# Altium schematic sheet FIT_PM_Dual_Range_AFE.SchDoc: FIT_PM_Dual_Range_AFE
size 420 x 297 mm; CheckedBy: G.Kasprowicz; Author: INR Moscow; CompanyName: WUT ISE; DrawnBy: F. Świtakowski; Organization: WUT ISE; Address1: PW ISE; Address2: Nowowiejska 15/19 00-665 Warsaw; Address3: gkasprow@gmail.com; DocumentNumber: 1; Revision: 2; SheetNumber: 1; SheetTotal: 21; ModifiedBy: -; CheckedDate: -; Title2: TOP; DivGrp: WUT ISE; Designer: INR RAS; ModifiedDate: -; ProjectName: Sensor Box
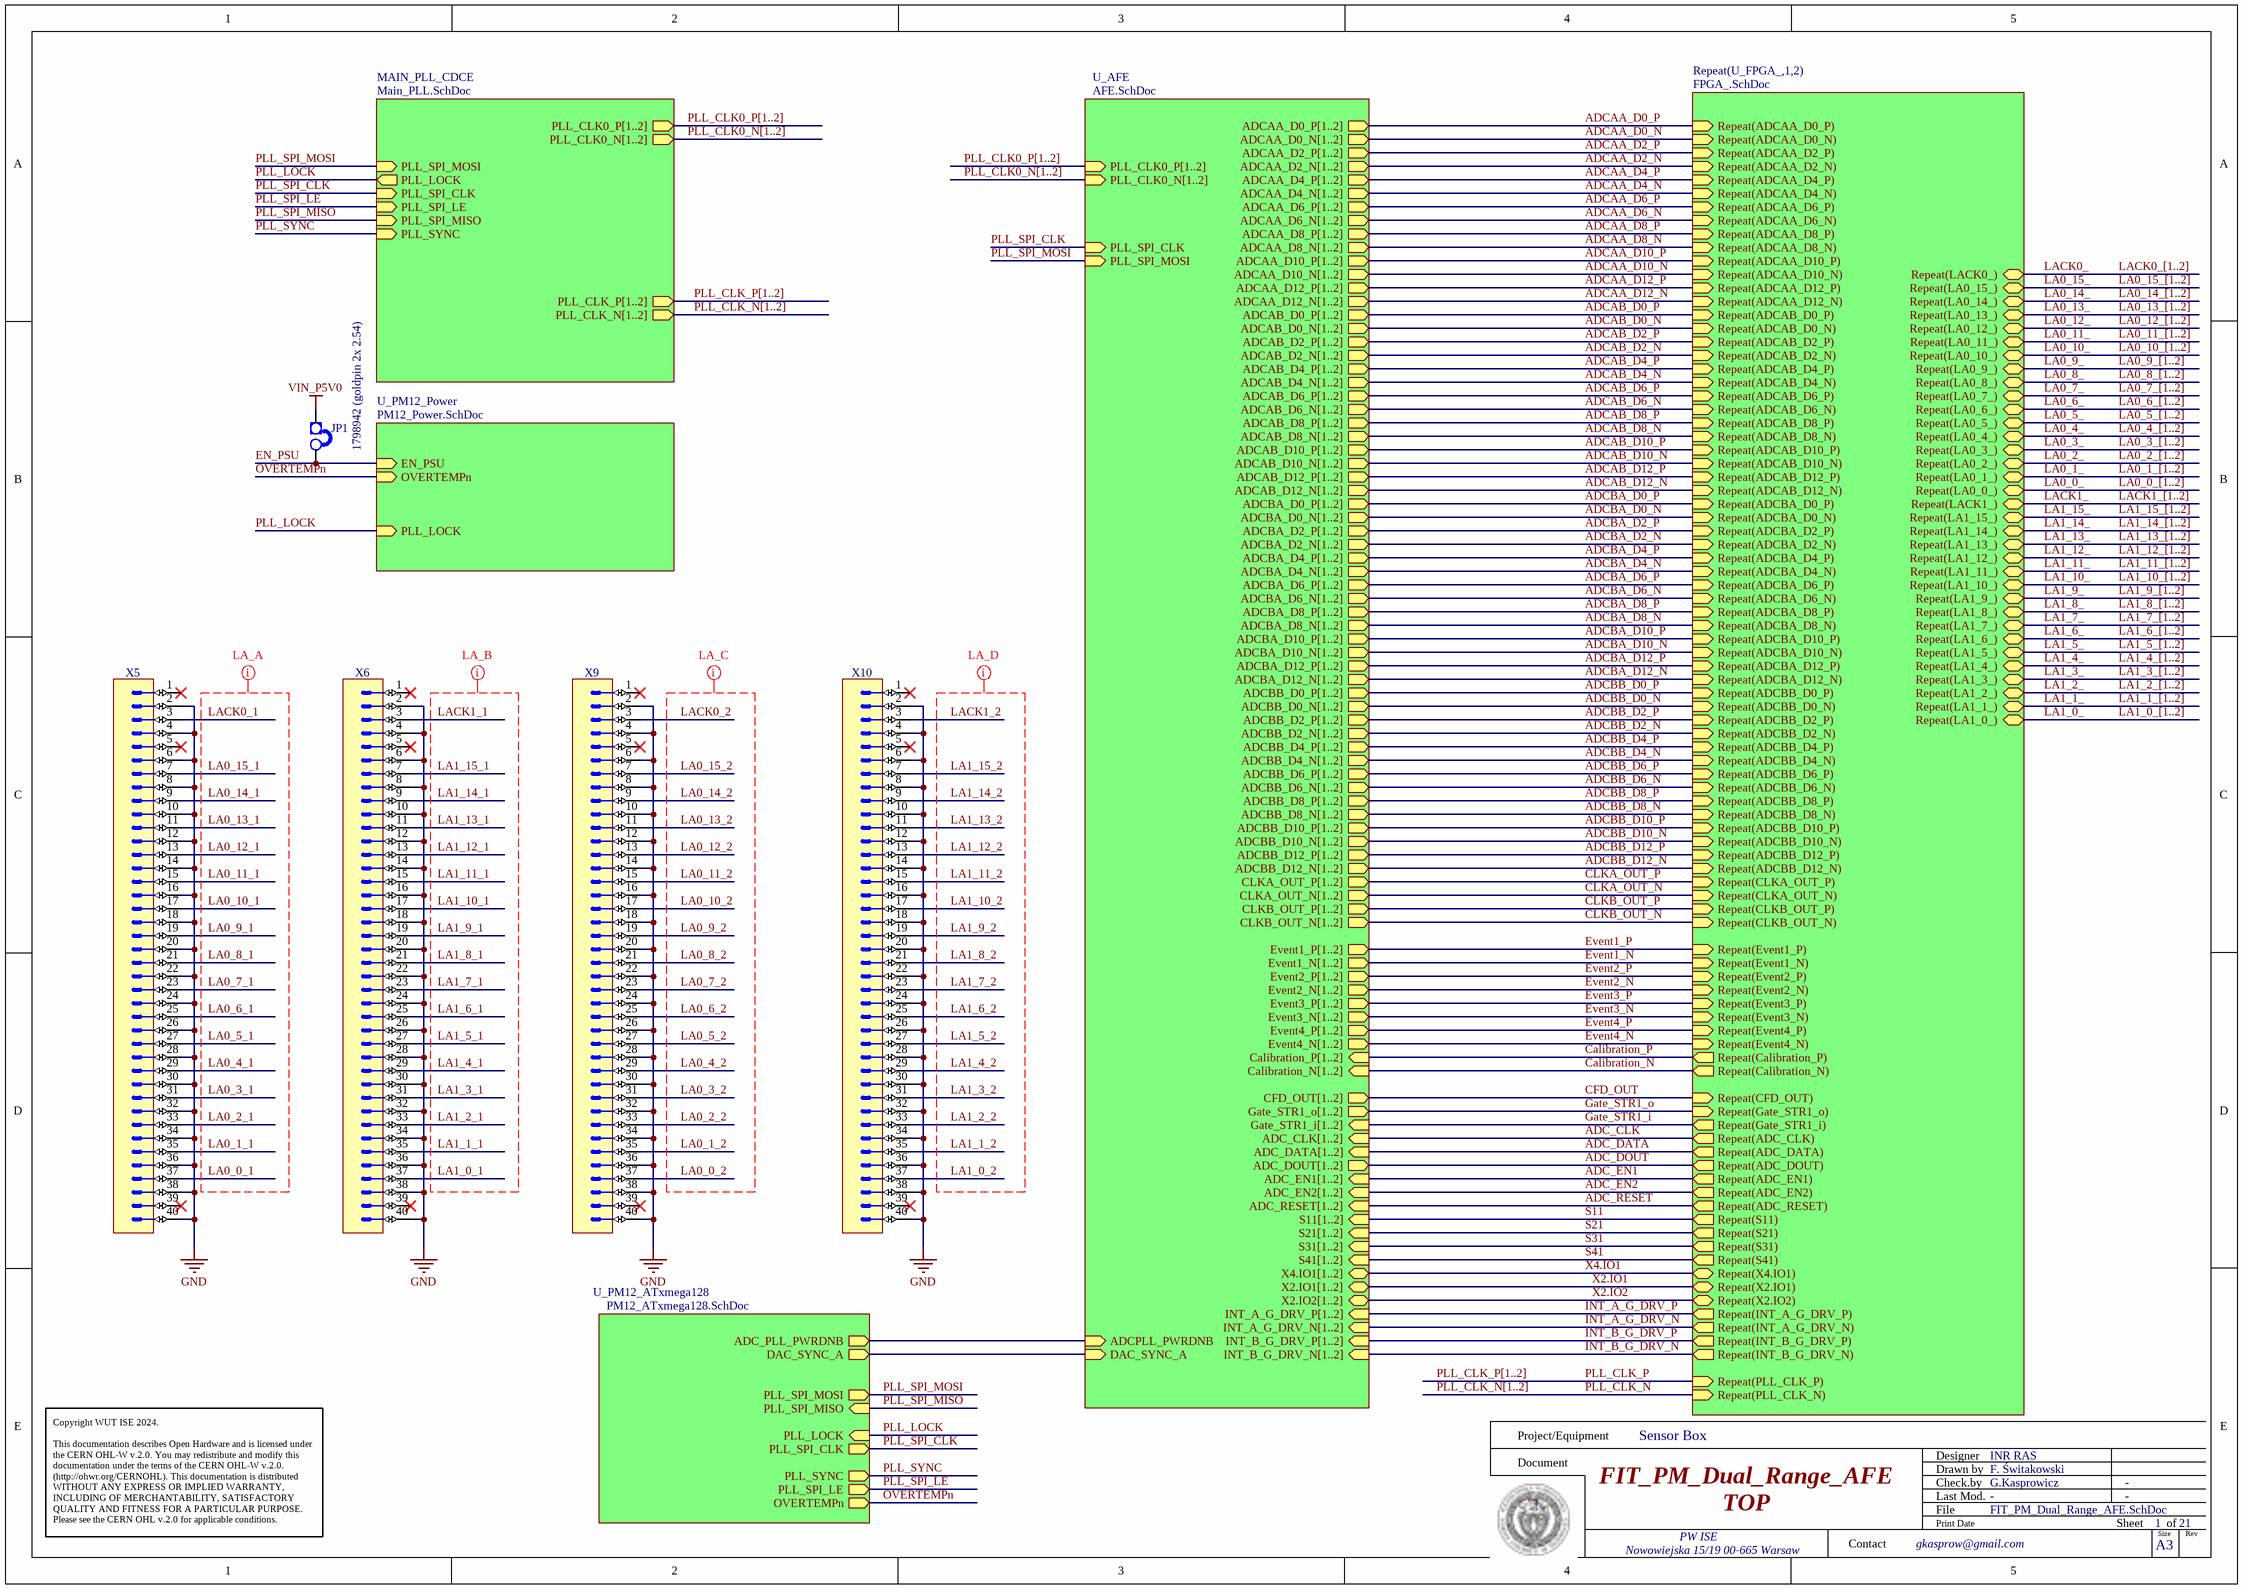
[diagram p0: FIT_PM_Dual_Range_AFE.SchDoc]

## Parts
JP1  1798942 (goldpin 2x 2.54)  [jump]
X5  (no value)  [CONNFLY_DS1013-40SSIB1-B-0]
X6  (no value)  [CONNFLY_DS1013-40SSIB1-B-0]
X9  (no value)  [CONNFLY_DS1013-40SSIB1-B-0]
X10  (no value)  [CONNFLY_DS1013-40SSIB1-B-0]

## Sub-sheets
MAIN_PLL_CDCE = Main_PLL.SchDoc: PLL_SPI_CLK (in), PLL_SYNC (in), PLL_LOCK (out), PLL_SPI_LE (in), PLL_SPI_MOSI (in), PLL_CLK0_P[1..2] (out), PLL_CLK0_N[1..2] (out), PLL_SPI_MISO (in), PLL_CLK_P[1..2] (out), PLL_CLK_N[1..2] (out)
Repeat(U_FPGA_,1,2) = FPGA_.SchDoc: Repeat(CLKB_OUT_P) (in), Repeat(CLKB_OUT_N) (in), Repeat(PLL_CLK_P) (in), Repeat(PLL_CLK_N) (in), Repeat(X4.IO1) (bidir), Repeat(X2.IO1) (bidir), Repeat(X2.IO2) (bidir), Repeat(ADCAA_D0_P) (in), Repeat(ADCAA_D0_N) (in), Repeat(ADCAA_D2_P) (in), Repeat(ADCAA_D2_N) (in), Repeat(ADCAA_D4_P) (in), Repeat(ADCAA_D4_N) (in), Repeat(ADCAA_D6_P) (in), Repeat(ADCAA_D6_N) (in), Repeat(ADCAA_D8_P) (in), Repeat(ADCAA_D8_N) (in), Repeat(ADCAA_D10_P) (in), Repeat(ADCAA_D10_N) (in), Repeat(ADCAA_D12_P) (in), Repeat(ADCAA_D12_N) (in), Repeat(CLKA_OUT_P) (in), Repeat(CLKA_OUT_N) (in), Repeat(ADCAB_D0_P) (in), Repeat(ADCAB_D0_N) (in), Repeat(ADCAB_D2_P) (in), Repeat(ADCAB_D2_N) (in), Repeat(ADCAB_D4_P) (in), Repeat(ADCAB_D4_N) (in), Repeat(ADCAB_D6_P) (in), Repeat(ADCAB_D6_N) (in), Repeat(ADCAB_D8_P) (in), Repeat(ADCAB_D8_N) (in), Repeat(ADCAB_D10_P) (in), Repeat(ADCAB_D10_N) (in), Repeat(ADCAB_D12_P) (in), Repeat(ADCAB_D12_N) (in), Repeat(ADCBA_D0_P) (in), Repeat(ADCBA_D0_N) (in), Repeat(ADCBA_D2_P) (in), Repeat(ADCBA_D2_N) (in), Repeat(ADCBA_D4_P) (in), Repeat(ADCBA_D4_N) (in), Repeat(ADCBA_D6_P) (in), Repeat(ADCBA_D6_N) (in), Repeat(ADCBA_D8_P) (in), Repeat(ADCBA_D8_N) (in), Repeat(ADCBA_D10_P) (in), Repeat(ADCBA_D10_N) (in), Repeat(ADCBA_D12_P) (in), Repeat(ADCBA_D12_N) (in), Repeat(ADCBB_D0_P) (in), Repeat(ADCBB_D0_N) (in), Repeat(ADCBB_D2_P) (in), Repeat(ADCBB_D2_N) (in), Repeat(ADCBB_D4_P) (in), Repeat(ADCBB_D4_N) (in), Repeat(ADCBB_D6_P) (in), Repeat(ADCBB_D6_N) (in), Repeat(ADCBB_D8_P) (in), Repeat(ADCBB_D8_N) (in), Repeat(ADCBB_D10_P) (in), Repeat(ADCBB_D10_N) (in), Repeat(ADCBB_D12_P) (in), Repeat(ADCBB_D12_N) (in), Repeat(Event1_P) (in), Repeat(Event1_N) (in), Repeat(CFD_OUT) (in), Repeat(Gate_STR1_o) (in), Repeat(Gate_STR1_i) (out), Repeat(ADC_CLK) (out), Repeat(ADC_DATA) (out), Repeat(ADC_DOUT) (out), Repeat(ADC_EN1) (out), Repeat(ADC_EN2) (out), Repeat(ADC_RESET) (out), Repeat(INT_A_G_DRV_P) (out), Repeat(INT_B_G_DRV_P) (out), Repeat(LACK0_) (bidir), Repeat(LA0_15_) (bidir), Repeat(LA0_14_) (bidir), Repeat(LA0_13_) (bidir), Repeat(LA0_12_) (bidir), Repeat(LA0_11_) (bidir), Repeat(LA0_10_) (bidir), Repeat(LA0_9_) (bidir), Repeat(LA0_8_) (bidir), Repeat(LA0_7_) (bidir), Repeat(LA0_6_) (bidir), Repeat(LA0_5_) (bidir), Repeat(LA0_4_) (bidir), Repeat(LA0_3_) (bidir), Repeat(LA0_2_) (bidir), Repeat(LA0_1_) (bidir), Repeat(LA0_0_) (bidir), Repeat(LACK1_) (bidir), Repeat(LA1_15_) (bidir), Repeat(LA1_14_) (bidir), Repeat(LA1_13_) (bidir), Repeat(LA1_12_) (bidir), Repeat(LA1_11_) (bidir), Repeat(LA1_10_) (bidir), Repeat(LA1_9_) (bidir), Repeat(LA1_8_) (bidir), Repeat(LA1_7_) (bidir), Repeat(LA1_6_) (bidir), Repeat(LA1_5_) (bidir), Repeat(LA1_4_) (bidir), Repeat(LA1_3_) (bidir), Repeat(LA1_2_) (bidir), Repeat(LA1_1_) (bidir), Repeat(LA1_0_) (bidir), Repeat(INT_A_G_DRV_N) (out), Repeat(INT_B_G_DRV_N) (out), Repeat(Event2_P) (in), Repeat(Event2_N) (in), Repeat(Event3_P) (in), Repeat(Event3_N) (in), Repeat(Event4_P) (in), Repeat(Event4_N) (in), Repeat(Calibration_P) (out), Repeat(Calibration_N) (out), Repeat(S11) (out), Repeat(S21) (out), Repeat(S31) (out), Repeat(S41) (out)
U_AFE = AFE.SchDoc: ADCPLL_PWRDNB (in), Event1_P[1..2] (out), PLL_CLK0_P[1..2] (in), PLL_CLK0_N[1..2] (in), ADCAA_D0_P[1..2] (out), ADCAA_D0_N[1..2] (out), ADCAA_D2_P[1..2] (out), ADCAA_D2_N[1..2] (out), ADCAA_D4_P[1..2] (out), ADCAA_D4_N[1..2] (out), ADCAA_D6_P[1..2] (out), ADCAA_D6_N[1..2] (out), ADCAA_D8_P[1..2] (out), ADCAA_D8_N[1..2] (out), ADCAA_D10_P[1..2] (out), ADCAA_D10_N[1..2] (out), ADCAA_D12_P[1..2] (out), ADCAA_D12_N[1..2] (out), ADCAB_D0_P[1..2] (out), ADCAB_D0_N[1..2] (out), ADCAB_D2_P[1..2] (out), ADCAB_D2_N[1..2] (out), ADCAB_D4_P[1..2] (out), ADCAB_D4_N[1..2] (out), ADCAB_D6_P[1..2] (out), ADCAB_D6_N[1..2] (out), ADCAB_D8_P[1..2] (out), ADCAB_D8_N[1..2] (out), ADCAB_D10_P[1..2] (out), ADCAB_D10_N[1..2] (out), ADCAB_D12_P[1..2] (out), ADCAB_D12_N[1..2] (out), ADCBA_D0_P[1..2] (out), ADCBA_D0_N[1..2] (out), ADCBA_D2_P[1..2] (out), ADCBA_D2_N[1..2] (out), ADCBA_D4_P[1..2] (out), ADCBA_D4_N[1..2] (out), ADCBA_D6_P[1..2] (out), ADCBA_D6_N[1..2] (out), ADCBA_D8_P[1..2] (out), ADCBA_D8_N[1..2] (out), ADCBA_D10_P[1..2] (out), ADCBA_D10_N[1..2] (out), ADCBA_D12_P[1..2] (out), ADCBA_D12_N[1..2] (out), ADCBB_D0_P[1..2] (out), ADCBB_D0_N[1..2] (out), ADCBB_D2_P[1..2] (out), ADCBB_D2_N[1..2] (out), ADCBB_D4_P[1..2] (out), ADCBB_D4_N[1..2] (out), ADCBB_D6_P[1..2] (out), ADCBB_D6_N[1..2] (out), ADCBB_D8_P[1..2] (out), ADCBB_D8_N[1..2] (out), ADCBB_D10_P[1..2] (out), ADCBB_D10_N[1..2] (out), ADCBB_D12_P[1..2] (out), ADCBB_D12_N[1..2] (out), CLKA_OUT_P[1..2] (out), CLKA_OUT_N[1..2] (out), CLKB_OUT_P[1..2] (out), CLKB_OUT_N[1..2] (out), DAC_SYNC_A (in), Event1_N[1..2] (out), CFD_OUT[1..2] (out), Gate_STR1_o[1..2] (out), Gate_STR1_i[1..2] (in), ADC_CLK[1..2] (in), ADC_DATA[1..2] (in), ADC_DOUT[1..2] (out), ADC_EN1[1..2] (in), ADC_EN2[1..2] (in), ADC_RESET[1..2] (in), PLL_SPI_CLK (in), PLL_SPI_MOSI (in), INT_A_G_DRV_P[1..2] (in), INT_B_G_DRV_P[1..2] (in), X4.IO1[1..2] (bidir), X2.IO1[1..2] (bidir), X2.IO2[1..2] (bidir), INT_A_G_DRV_N[1..2] (in), INT_B_G_DRV_N[1..2] (in), Event2_P[1..2] (out), Event2_N[1..2] (out), Event3_P[1..2] (out), Event3_N[1..2] (out), Event4_P[1..2] (out), Event4_N[1..2] (out), Calibration_P[1..2] (in), Calibration_N[1..2] (in), S11[1..2] (in), S21[1..2] (in), S31[1..2] (in), S41[1..2] (in)
U_PM12_ATxmega128 = PM12_ATxmega128.SchDoc: ADC_PLL_PWRDNB (out), PLL_SPI_MOSI (out), DAC_SYNC_A (out), PLL_SPI_CLK (out), PLL_SPI_MISO (in), PLL_SYNC (out), PLL_LOCK (in), PLL_SPI_LE (out), OVERTEMPn (out)
U_PM12_Power = PM12_Power.SchDoc: EN_PSU (in), OVERTEMPn (in), PLL_LOCK (in)

## Nets
GND: X5.2 X5.4 X5.6 X5.8 X5.10 X5.12 X5.14 X5.16 X5.18 X5.20 X5.22 X5.24 X5.26 X5.28 X5.30 X5.32 X5.34 X5.36 X5.38 X5.40 X6.2 X6.4 X6.6 X6.8 X6.10 X6.12 X6.14 X6.16 X6.18 X6.20 X6.22 X6.24 X6.26 X6.28 X6.30 X6.32 X6.34 X6.36 X6.38 X6.40 X9.2 X9.4 X9.6 X9.8 X9.10 X9.12 X9.14 X9.16 X9.18 X9.20 X9.22 X9.24 X9.26 X9.28 X9.30 X9.32 X9.34 X9.36 X9.38 X9.40 X10.2 X10.4 X10.6 X10.8 X10.10 X10.12 X10.14 X10.16 X10.18 X10.20 X10.22 X10.24 X10.26 X10.28 X10.30 X10.32 X10.34 X10.36 X10.38 X10.40
VIN_P5V0: JP1.1(E1)
ADC_CLK: sheet Repeat(U_FPGA_,1,2)/Repeat(ADC_CLK)
ADC_DATA: sheet Repeat(U_FPGA_,1,2)/Repeat(ADC_DATA)
ADC_DOUT: sheet Repeat(U_FPGA_,1,2)/Repeat(ADC_DOUT)
ADC_EN1: sheet Repeat(U_FPGA_,1,2)/Repeat(ADC_EN1)
ADC_EN2: sheet Repeat(U_FPGA_,1,2)/Repeat(ADC_EN2)
ADC_RESET: sheet Repeat(U_FPGA_,1,2)/Repeat(ADC_RESET)
ADCAA_D0_N: sheet Repeat(U_FPGA_,1,2)/Repeat(ADCAA_D0_N)
ADCAA_D0_P: sheet Repeat(U_FPGA_,1,2)/Repeat(ADCAA_D0_P)
ADCAA_D2_N: sheet Repeat(U_FPGA_,1,2)/Repeat(ADCAA_D2_N)
ADCAA_D2_P: sheet Repeat(U_FPGA_,1,2)/Repeat(ADCAA_D2_P)
ADCAA_D4_N: sheet Repeat(U_FPGA_,1,2)/Repeat(ADCAA_D4_N)
ADCAA_D4_P: sheet Repeat(U_FPGA_,1,2)/Repeat(ADCAA_D4_P)
ADCAA_D6_N: sheet Repeat(U_FPGA_,1,2)/Repeat(ADCAA_D6_N)
ADCAA_D6_P: sheet Repeat(U_FPGA_,1,2)/Repeat(ADCAA_D6_P)
ADCAA_D8_N: sheet Repeat(U_FPGA_,1,2)/Repeat(ADCAA_D8_N)
ADCAA_D8_P: sheet Repeat(U_FPGA_,1,2)/Repeat(ADCAA_D8_P)
ADCAA_D10_N: sheet Repeat(U_FPGA_,1,2)/Repeat(ADCAA_D10_N)
ADCAA_D10_P: sheet Repeat(U_FPGA_,1,2)/Repeat(ADCAA_D10_P)
ADCAA_D12_N: sheet Repeat(U_FPGA_,1,2)/Repeat(ADCAA_D12_N)
ADCAA_D12_P: sheet Repeat(U_FPGA_,1,2)/Repeat(ADCAA_D12_P)
ADCAB_D0_N: sheet Repeat(U_FPGA_,1,2)/Repeat(ADCAB_D0_N)
ADCAB_D0_P: sheet Repeat(U_FPGA_,1,2)/Repeat(ADCAB_D0_P)
ADCAB_D2_N: sheet Repeat(U_FPGA_,1,2)/Repeat(ADCAB_D2_N)
ADCAB_D2_P: sheet Repeat(U_FPGA_,1,2)/Repeat(ADCAB_D2_P)
ADCAB_D4_N: sheet Repeat(U_FPGA_,1,2)/Repeat(ADCAB_D4_N)
ADCAB_D4_P: sheet Repeat(U_FPGA_,1,2)/Repeat(ADCAB_D4_P)
ADCAB_D6_N: sheet Repeat(U_FPGA_,1,2)/Repeat(ADCAB_D6_N)
ADCAB_D6_P: sheet Repeat(U_FPGA_,1,2)/Repeat(ADCAB_D6_P)
ADCAB_D8_N: sheet Repeat(U_FPGA_,1,2)/Repeat(ADCAB_D8_N)
ADCAB_D8_P: sheet Repeat(U_FPGA_,1,2)/Repeat(ADCAB_D8_P)
ADCAB_D10_N: sheet Repeat(U_FPGA_,1,2)/Repeat(ADCAB_D10_N)
ADCAB_D10_P: sheet Repeat(U_FPGA_,1,2)/Repeat(ADCAB_D10_P)
ADCAB_D12_N: sheet Repeat(U_FPGA_,1,2)/Repeat(ADCAB_D12_N)
ADCAB_D12_P: sheet Repeat(U_FPGA_,1,2)/Repeat(ADCAB_D12_P)
ADCBA_D0_N: sheet Repeat(U_FPGA_,1,2)/Repeat(ADCBA_D0_N)
ADCBA_D0_P: sheet Repeat(U_FPGA_,1,2)/Repeat(ADCBA_D0_P)
ADCBA_D2_N: sheet Repeat(U_FPGA_,1,2)/Repeat(ADCBA_D2_N)
ADCBA_D2_P: sheet Repeat(U_FPGA_,1,2)/Repeat(ADCBA_D2_P)
ADCBA_D4_N: sheet Repeat(U_FPGA_,1,2)/Repeat(ADCBA_D4_N)
ADCBA_D4_P: sheet Repeat(U_FPGA_,1,2)/Repeat(ADCBA_D4_P)
ADCBA_D6_N: sheet Repeat(U_FPGA_,1,2)/Repeat(ADCBA_D6_N)
ADCBA_D6_P: sheet Repeat(U_FPGA_,1,2)/Repeat(ADCBA_D6_P)
ADCBA_D8_N: sheet Repeat(U_FPGA_,1,2)/Repeat(ADCBA_D8_N)
ADCBA_D8_P: sheet Repeat(U_FPGA_,1,2)/Repeat(ADCBA_D8_P)
ADCBA_D10_N: sheet Repeat(U_FPGA_,1,2)/Repeat(ADCBA_D10_N)
ADCBA_D10_P: sheet Repeat(U_FPGA_,1,2)/Repeat(ADCBA_D10_P)
ADCBA_D12_N: sheet Repeat(U_FPGA_,1,2)/Repeat(ADCBA_D12_N)
ADCBA_D12_P: sheet Repeat(U_FPGA_,1,2)/Repeat(ADCBA_D12_P)
ADCBB_D0_N: sheet Repeat(U_FPGA_,1,2)/Repeat(ADCBB_D0_N)
ADCBB_D0_P: sheet Repeat(U_FPGA_,1,2)/Repeat(ADCBB_D0_P)
ADCBB_D2_N: sheet Repeat(U_FPGA_,1,2)/Repeat(ADCBB_D2_N)
ADCBB_D2_P: sheet Repeat(U_FPGA_,1,2)/Repeat(ADCBB_D2_P)
ADCBB_D4_N: sheet Repeat(U_FPGA_,1,2)/Repeat(ADCBB_D4_N)
ADCBB_D4_P: sheet Repeat(U_FPGA_,1,2)/Repeat(ADCBB_D4_P)
ADCBB_D6_N: sheet Repeat(U_FPGA_,1,2)/Repeat(ADCBB_D6_N)
ADCBB_D6_P: sheet Repeat(U_FPGA_,1,2)/Repeat(ADCBB_D6_P)
ADCBB_D8_N: sheet Repeat(U_FPGA_,1,2)/Repeat(ADCBB_D8_N)
ADCBB_D8_P: sheet Repeat(U_FPGA_,1,2)/Repeat(ADCBB_D8_P)
ADCBB_D10_N: sheet Repeat(U_FPGA_,1,2)/Repeat(ADCBB_D10_N)
ADCBB_D10_P: sheet Repeat(U_FPGA_,1,2)/Repeat(ADCBB_D10_P)
ADCBB_D12_N: sheet Repeat(U_FPGA_,1,2)/Repeat(ADCBB_D12_N)
ADCBB_D12_P: sheet Repeat(U_FPGA_,1,2)/Repeat(ADCBB_D12_P)
Calibration_N: sheet Repeat(U_FPGA_,1,2)/Repeat(Calibration_N)
Calibration_P: sheet Repeat(U_FPGA_,1,2)/Repeat(Calibration_P)
CFD_OUT: sheet Repeat(U_FPGA_,1,2)/Repeat(CFD_OUT)
CLKA_OUT_N: sheet Repeat(U_FPGA_,1,2)/Repeat(CLKA_OUT_N)
CLKA_OUT_P: sheet Repeat(U_FPGA_,1,2)/Repeat(CLKA_OUT_P)
CLKB_OUT_N: sheet Repeat(U_FPGA_,1,2)/Repeat(CLKB_OUT_N)
CLKB_OUT_P: sheet Repeat(U_FPGA_,1,2)/Repeat(CLKB_OUT_P)
EN_PSU: JP1.2(E2) ; sheet U_PM12_Power/EN_PSU
Event1_N: sheet Repeat(U_FPGA_,1,2)/Repeat(Event1_N)
Event1_P: sheet Repeat(U_FPGA_,1,2)/Repeat(Event1_P)
Event2_N: sheet Repeat(U_FPGA_,1,2)/Repeat(Event2_N)
Event2_P: sheet Repeat(U_FPGA_,1,2)/Repeat(Event2_P)
Event3_N: sheet Repeat(U_FPGA_,1,2)/Repeat(Event3_N)
Event3_P: sheet Repeat(U_FPGA_,1,2)/Repeat(Event3_P)
Event4_N: sheet Repeat(U_FPGA_,1,2)/Repeat(Event4_N)
Event4_P: sheet Repeat(U_FPGA_,1,2)/Repeat(Event4_P)
Gate_STR1_i: sheet Repeat(U_FPGA_,1,2)/Repeat(Gate_STR1_i)
Gate_STR1_o: sheet Repeat(U_FPGA_,1,2)/Repeat(Gate_STR1_o)
INT_A_G_DRV_N: sheet Repeat(U_FPGA_,1,2)/Repeat(INT_A_G_DRV_N)
INT_A_G_DRV_P: sheet Repeat(U_FPGA_,1,2)/Repeat(INT_A_G_DRV_P)
INT_B_G_DRV_N: sheet Repeat(U_FPGA_,1,2)/Repeat(INT_B_G_DRV_N)
INT_B_G_DRV_P: sheet Repeat(U_FPGA_,1,2)/Repeat(INT_B_G_DRV_P)
LA0_0_: sheet Repeat(U_FPGA_,1,2)/Repeat(LA0_0_)
LA0_0_1: X5.37
LA0_0_2: X9.37
LA0_1_: sheet Repeat(U_FPGA_,1,2)/Repeat(LA0_1_)
LA0_1_1: X5.35
LA0_1_2: X9.35
LA0_2_: sheet Repeat(U_FPGA_,1,2)/Repeat(LA0_2_)
LA0_2_1: X5.33
LA0_2_2: X9.33
LA0_3_: sheet Repeat(U_FPGA_,1,2)/Repeat(LA0_3_)
LA0_3_1: X5.31
LA0_3_2: X9.31
LA0_4_: sheet Repeat(U_FPGA_,1,2)/Repeat(LA0_4_)
LA0_4_1: X5.29
LA0_4_2: X9.29
LA0_5_: sheet Repeat(U_FPGA_,1,2)/Repeat(LA0_5_)
LA0_5_1: X5.27
LA0_5_2: X9.27
LA0_6_: sheet Repeat(U_FPGA_,1,2)/Repeat(LA0_6_)
LA0_6_1: X5.25
LA0_6_2: X9.25
LA0_7_: sheet Repeat(U_FPGA_,1,2)/Repeat(LA0_7_)
LA0_7_1: X5.23
LA0_7_2: X9.23
LA0_8_: sheet Repeat(U_FPGA_,1,2)/Repeat(LA0_8_)
LA0_8_1: X5.21
LA0_8_2: X9.21
LA0_9_: sheet Repeat(U_FPGA_,1,2)/Repeat(LA0_9_)
LA0_9_1: X5.19
LA0_9_2: X9.19
LA0_10_: sheet Repeat(U_FPGA_,1,2)/Repeat(LA0_10_)
LA0_10_1: X5.17
LA0_10_2: X9.17
LA0_11_: sheet Repeat(U_FPGA_,1,2)/Repeat(LA0_11_)
LA0_11_1: X5.15
LA0_11_2: X9.15
LA0_12_: sheet Repeat(U_FPGA_,1,2)/Repeat(LA0_12_)
LA0_12_1: X5.13
LA0_12_2: X9.13
LA0_13_: sheet Repeat(U_FPGA_,1,2)/Repeat(LA0_13_)
LA0_13_1: X5.11
LA0_13_2: X9.11
LA0_14_: sheet Repeat(U_FPGA_,1,2)/Repeat(LA0_14_)
LA0_14_1: X5.9
LA0_14_2: X9.9
LA0_15_: sheet Repeat(U_FPGA_,1,2)/Repeat(LA0_15_)
LA0_15_1: X5.7
LA0_15_2: X9.7
LA1_0_: sheet Repeat(U_FPGA_,1,2)/Repeat(LA1_0_)
LA1_0_1: X6.37
LA1_0_2: X10.37
LA1_1_: sheet Repeat(U_FPGA_,1,2)/Repeat(LA1_1_)
LA1_1_1: X6.35
LA1_1_2: X10.35
LA1_2_: sheet Repeat(U_FPGA_,1,2)/Repeat(LA1_2_)
LA1_2_1: X6.33
LA1_2_2: X10.33
LA1_3_: sheet Repeat(U_FPGA_,1,2)/Repeat(LA1_3_)
LA1_3_1: X6.31
LA1_3_2: X10.31
LA1_4_: sheet Repeat(U_FPGA_,1,2)/Repeat(LA1_4_)
LA1_4_1: X6.29
LA1_4_2: X10.29
LA1_5_: sheet Repeat(U_FPGA_,1,2)/Repeat(LA1_5_)
LA1_5_1: X6.27
LA1_5_2: X10.27
LA1_6_: sheet Repeat(U_FPGA_,1,2)/Repeat(LA1_6_)
LA1_6_1: X6.25
LA1_6_2: X10.25
LA1_7_: sheet Repeat(U_FPGA_,1,2)/Repeat(LA1_7_)
LA1_7_1: X6.23
LA1_7_2: X10.23
LA1_8_: sheet Repeat(U_FPGA_,1,2)/Repeat(LA1_8_)
LA1_8_1: X6.21
LA1_8_2: X10.21
LA1_9_: sheet Repeat(U_FPGA_,1,2)/Repeat(LA1_9_)
LA1_9_1: X6.19
LA1_9_2: X10.19
LA1_10_: sheet Repeat(U_FPGA_,1,2)/Repeat(LA1_10_)
LA1_10_1: X6.17
LA1_10_2: X10.17
LA1_11_: sheet Repeat(U_FPGA_,1,2)/Repeat(LA1_11_)
LA1_11_1: X6.15
LA1_11_2: X10.15
LA1_12_: sheet Repeat(U_FPGA_,1,2)/Repeat(LA1_12_)
LA1_12_1: X6.13
LA1_12_2: X10.13
LA1_13_: sheet Repeat(U_FPGA_,1,2)/Repeat(LA1_13_)
LA1_13_1: X6.11
LA1_13_2: X10.11
LA1_14_: sheet Repeat(U_FPGA_,1,2)/Repeat(LA1_14_)
LA1_14_1: X6.9
LA1_14_2: X10.9
LA1_15_: sheet Repeat(U_FPGA_,1,2)/Repeat(LA1_15_)
LA1_15_1: X6.7
LA1_15_2: X10.7
LACK0_: sheet Repeat(U_FPGA_,1,2)/Repeat(LACK0_)
LACK0_1: X5.3
LACK0_2: X9.3
LACK1_: sheet Repeat(U_FPGA_,1,2)/Repeat(LACK1_)
LACK1_1: X6.3
LACK1_2: X10.3
OVERTEMPn: sheet U_PM12_Power/OVERTEMPn, sheet U_PM12_ATxmega128/OVERTEMPn
PLL_CLK_N: sheet Repeat(U_FPGA_,1,2)/Repeat(PLL_CLK_N)
PLL_CLK_P: sheet Repeat(U_FPGA_,1,2)/Repeat(PLL_CLK_P)
PLL_LOCK: sheet MAIN_PLL_CDCE/PLL_LOCK, sheet U_PM12_Power/PLL_LOCK, sheet U_PM12_ATxmega128/PLL_LOCK
PLL_SPI_CLK: sheet MAIN_PLL_CDCE/PLL_SPI_CLK, sheet U_AFE/PLL_SPI_CLK, sheet U_PM12_ATxmega128/PLL_SPI_CLK
PLL_SPI_LE: sheet MAIN_PLL_CDCE/PLL_SPI_LE, sheet U_PM12_ATxmega128/PLL_SPI_LE
PLL_SPI_MISO: sheet MAIN_PLL_CDCE/PLL_SPI_MISO, sheet U_PM12_ATxmega128/PLL_SPI_MISO
PLL_SPI_MOSI: sheet MAIN_PLL_CDCE/PLL_SPI_MOSI, sheet U_AFE/PLL_SPI_MOSI, sheet U_PM12_ATxmega128/PLL_SPI_MOSI
PLL_SYNC: sheet MAIN_PLL_CDCE/PLL_SYNC, sheet U_PM12_ATxmega128/PLL_SYNC
S11: sheet Repeat(U_FPGA_,1,2)/Repeat(S11)
S21: sheet Repeat(U_FPGA_,1,2)/Repeat(S21)
S31: sheet Repeat(U_FPGA_,1,2)/Repeat(S31)
S41: sheet Repeat(U_FPGA_,1,2)/Repeat(S41)
X2.IO1: sheet Repeat(U_FPGA_,1,2)/Repeat(X2.IO1)
X2.IO2: sheet Repeat(U_FPGA_,1,2)/Repeat(X2.IO2)
X4.IO1: sheet Repeat(U_FPGA_,1,2)/Repeat(X4.IO1)
(unnamed): sheet U_AFE/ADCPLL_PWRDNB, sheet U_PM12_ATxmega128/ADC_PLL_PWRDNB
(unnamed): sheet U_AFE/DAC_SYNC_A, sheet U_PM12_ATxmega128/DAC_SYNC_A

Not connected (* = marked no-connect by the designer): X5 1* 5* 39*; X6 1* 5* 39*; X9 1* 5* 39*; X10 1* 5* 39*

## Buses and harness runs
bus LA0_0_[1..2]
bus LA0_1_[1..2]
bus LA0_2_[1..2]
bus LA0_3_[1..2]
bus LA0_4_[1..2]
bus LA0_5_[1..2]
bus LA0_6_[1..2]
bus LA0_7_[1..2]
bus LA0_8_[1..2]
bus LA0_9_[1..2]
bus LA0_10_[1..2]
bus LA0_11_[1..2]
bus LA0_12_[1..2]
bus LA0_13_[1..2]
bus LA0_14_[1..2]
bus LA0_15_[1..2]
bus LA1_0_[1..2]
bus LA1_1_[1..2]
bus LA1_2_[1..2]
bus LA1_3_[1..2]
bus LA1_4_[1..2]
bus LA1_5_[1..2]
bus LA1_6_[1..2]
bus LA1_7_[1..2]
bus LA1_8_[1..2]
bus LA1_9_[1..2]
bus LA1_10_[1..2]
bus LA1_11_[1..2]
bus LA1_12_[1..2]
bus LA1_13_[1..2]
bus LA1_14_[1..2]
bus LA1_15_[1..2]
bus LACK0_[1..2]
bus LACK1_[1..2]
bus PLL_CLK0_N[1..2] = sheet MAIN_PLL_CDCE/PLL_CLK0_N[1..2]
bus PLL_CLK0_N[1..2] = sheet U_AFE/PLL_CLK0_N[1..2]
bus PLL_CLK0_P[1..2] = sheet MAIN_PLL_CDCE/PLL_CLK0_P[1..2]
bus PLL_CLK0_P[1..2] = sheet U_AFE/PLL_CLK0_P[1..2]
bus PLL_CLK_N[1..2]
bus PLL_CLK_N[1..2] = sheet MAIN_PLL_CDCE/PLL_CLK_N[1..2]
bus PLL_CLK_P[1..2]
bus PLL_CLK_P[1..2] = sheet MAIN_PLL_CDCE/PLL_CLK_P[1..2]

## Layout directives
net class LA_A: LA0_0_1, LA0_1_1, LA0_2_1, LA0_3_1, LA0_4_1, LA0_5_1, LA0_6_1, LA0_7_1, LA0_8_1, LA0_9_1, LA0_10_1, LA0_11_1, LA0_12_1, LA0_13_1, LA0_14_1, LA0_15_1, LACK0_1
net class LA_B: LA1_0_1, LA1_1_1, LA1_2_1, LA1_3_1, LA1_4_1, LA1_5_1, LA1_6_1, LA1_7_1, LA1_8_1, LA1_9_1, LA1_10_1, LA1_11_1, LA1_12_1, LA1_13_1, LA1_14_1, LA1_15_1, LACK1_1
net class LA_C: LA0_0_2, LA0_1_2, LA0_2_2, LA0_3_2, LA0_4_2, LA0_5_2, LA0_6_2, LA0_7_2, LA0_8_2, LA0_9_2, LA0_10_2, LA0_11_2, LA0_12_2, LA0_13_2, LA0_14_2, LA0_15_2, LACK0_2
net class LA_D: LA1_0_2, LA1_1_2, LA1_2_2, LA1_3_2, LA1_4_2, LA1_5_2, LA1_6_2, LA1_7_2, LA1_8_2, LA1_9_2, LA1_10_2, LA1_11_2, LA1_12_2, LA1_13_2, LA1_14_2, LA1_15_2, LACK1_2

## Notes on the sheet
- Project/Equipment
- Document
- Designer
- Drawn by
- Check.by
- Copyright WUT ISE 2024.
  This documentation describes Open Hardware and is licensed under the CERN OHL-W v.2.0. You may redistribute and modify this documentation under the terms of the CERN OHL-W v.2.0. (http://ohwr.org/CERNOHL). This documentation is distributed WITHOUT ANY EXPRESS OR IMPLIED WARRANTY, INCLUDING OF MERCHANTABILITY, SATISFACTORY QUALITY AND FITNESS FOR A PARTICULAR PURPOSE. Please see the CERN OHL v.2.0 for applicable conditions.
- Contact
- File
- Last Mod.
- Print Date
- Sheet
- Size
- A3
- of
- Rev

## Library data of the parts
JP1 = JUMPER: Manufacturer Part Number: 68001-102HLF; Supplier 1: Farnell; Supplier Part Number 1: 1798942
X5 X6 X9 X10 = CONNFLY_DS1013-40SSIB1-B-0: Connector 40 Male; Part Description: 40 Contacts, 2.54mm Box Header V/T,R/A & SMT Type; PressFit: No; Part Number: CONNFLY_DS1013-40SSIB1-B-0; Component Kind: Standard; Component Type: Standard; Pin Count: 40; Mounted: Yes; Socket: No; SMD: No; Sense: No; Status: None; Manufacturer: CONNFLY; Manufacturer Part Number: DS1013-40SSIB1-B-0; ComponentHeight: 9.1mm; HelpURL: \\cern.ch\dfs\Applications\Altium\Datasheets\CONNFLY_DS1013.pdf; Author: CERN DEM HF; CreateDate: 30.05.2024; LatestRevisionDate: 30.05.2024